# EAGLE design Encoder (EAGLE 9.5.0)
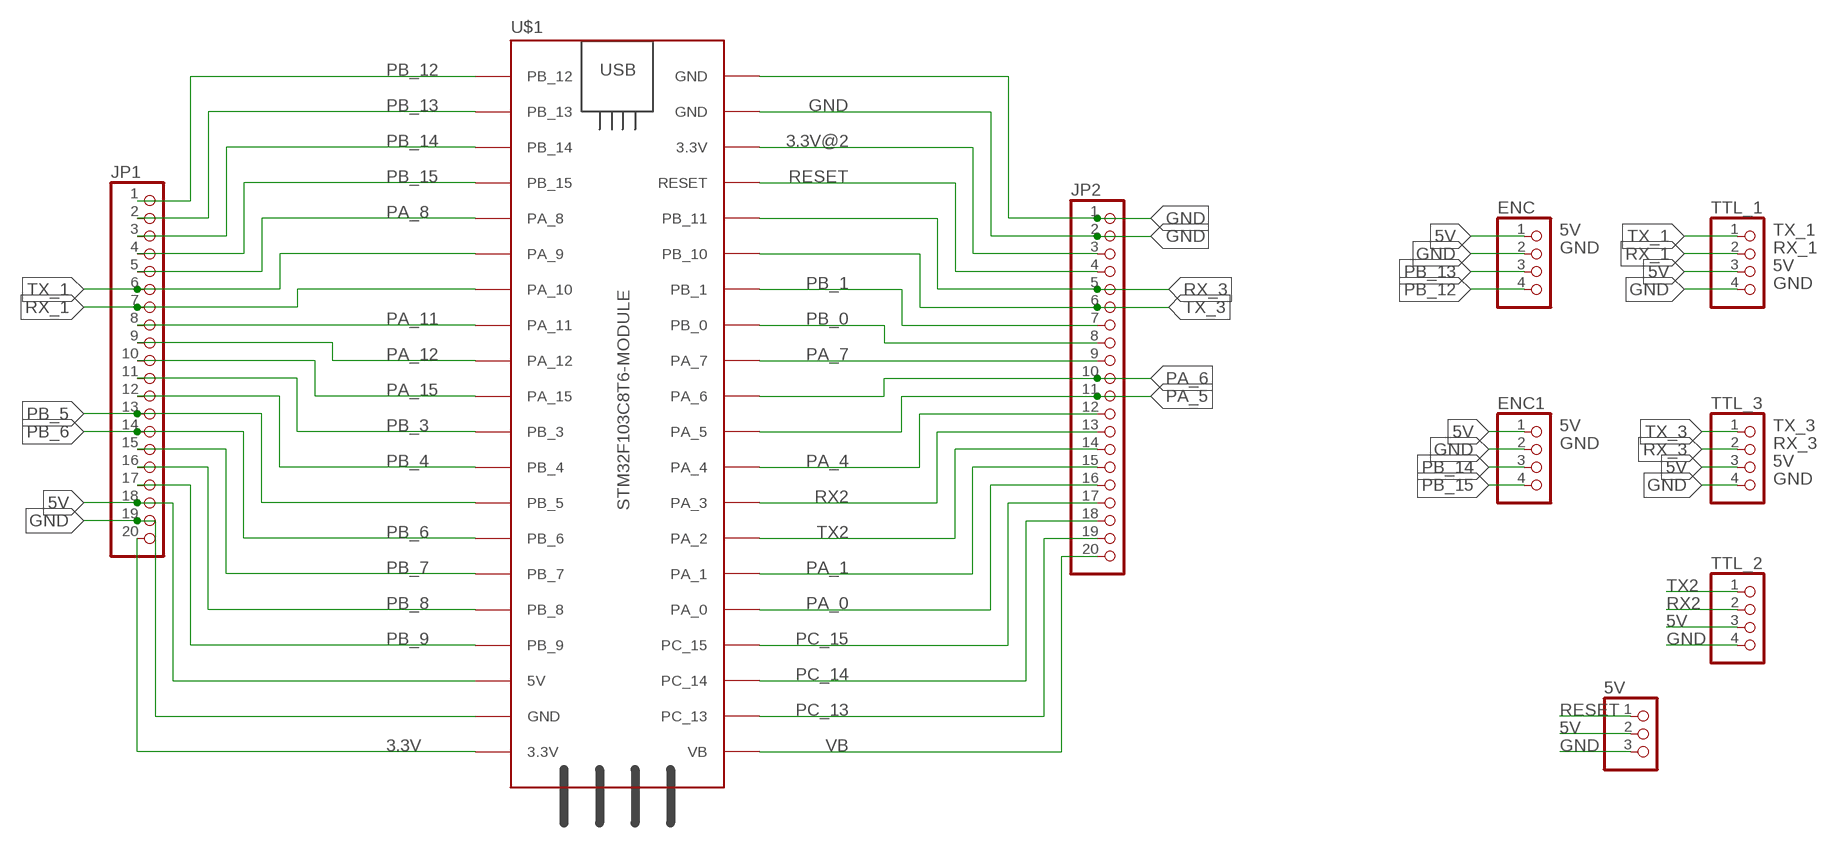
[diagram p0: schematic, sheet 1]

## Parts
5V  PINHD-3_DATA  [1X03_DATA]
ENC  PINHD-4_DATA  [1X04_DATA]
ENC1  PINHD-4_DATA  [1X04_DATA]
JP1  PINHD-1X20  [1X20]
JP2  PINHD-1X20  [1X20]
TTL_1  PINHD-4_DATA  [1X04_DATA]
TTL_2  PINHD-4_DATA  [1X04_DATA]
TTL_3  PINHD-4_DATA  [1X04_DATA]
U$1  STM32F103C8T6-MODULE  [STM32F103C8T6-MODULE]

## Nets
3.3V: JP1.20 U$1.3.3V_1(3.3V)
3.3V@2: JP2.3 U$1.3.3V_2(3.3V)
5V: 5V.2 ENC1.1 ENC.1 JP1.18 TTL_1.3 TTL_2.3 TTL_3.3 U$1.5V
GND: 5V.3 ENC1.2 ENC.2 JP1.19 JP2.1 JP2.2 TTL_1.4 TTL_2.4 TTL_3.4 U$1.GND_1(GND) U$1.GND_2(GND) U$1.GND_3(GND)
PA_0: JP2.16 U$1.PA_0
PA_1: JP2.15 U$1.PA_1
PA_4: JP2.12 U$1.PA_4
PA_5: JP2.11 U$1.PA_5
PA_6: JP2.10 U$1.PA_6
PA_7: JP2.9 U$1.PA_7
PA_8: JP1.5 U$1.PA_8
PA_11: JP1.8 U$1.PA_11
PA_12: JP1.9 U$1.PA_12
PA_15: JP1.10 U$1.PA_15
PB_0: JP2.8 U$1.PB_0
PB_1: JP2.7 U$1.PB_1
PB_3: JP1.11 U$1.PB_3
PB_4: JP1.12 U$1.PB_4
PB_5: JP1.13 U$1.PB_5
PB_6: JP1.14 U$1.PB_6
PB_7: JP1.15 U$1.PB_7
PB_8: JP1.16 U$1.PB_8
PB_9: JP1.17 U$1.PB_9
PB_12: ENC.4 JP1.1 U$1.PB_12
PB_13: ENC.3 JP1.2 U$1.PB_13
PB_14: ENC1.3 JP1.3 U$1.PB_14
PB_15: ENC1.4 JP1.4 U$1.PB_15
PC_13: JP2.19 U$1.PC_13
PC_14: JP2.18 U$1.PC_14
PC_15: JP2.17 U$1.PC_15
RESET: 5V.1 JP2.4 U$1.RESET
RX2: JP2.13 TTL_2.2 U$1.PA_3
RX_1: JP1.7 TTL_1.2 U$1.PA_10
RX_3: JP2.5 TTL_3.2 U$1.PB_11
TX2: JP2.14 TTL_2.1 U$1.PA_2
TX_1: JP1.6 TTL_1.1 U$1.PA_9
TX_3: JP2.6 TTL_3.1 U$1.PB_10
VB: JP2.20 U$1.VB

## Library data of the parts
5V = MIA_LIBRARY-2-2-2:PINHD-3_DATA: PIN HEADER
ENC ENC1 TTL_1-TTL_3 = MIA_LIBRARY-2-2-2:PINHD-4_DATA: PIN HEADER
JP1 JP2 = pinhead:PINHD-1X20: PIN HEADER
U$1 = MIA_LIBRARY-2-2-2:STM32F103C8T6-MODULE: STM32F103C8T6 module with ARM Cortex-3, 20kB SRAM, 64kB Flash, 72MHz

## Board
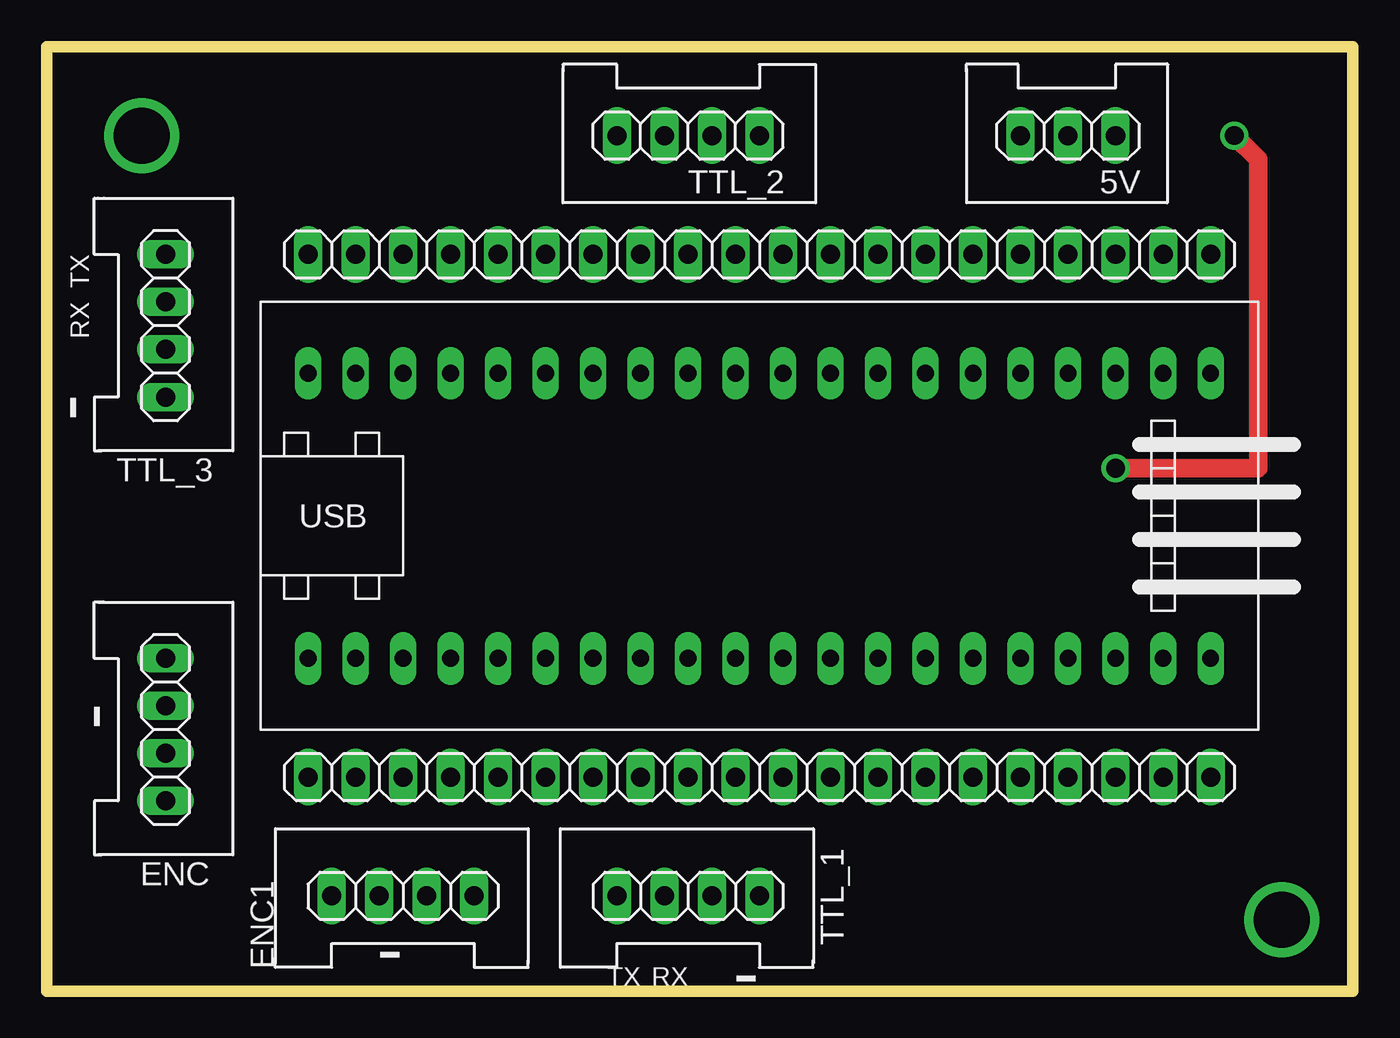
[diagram p1: board, top side]
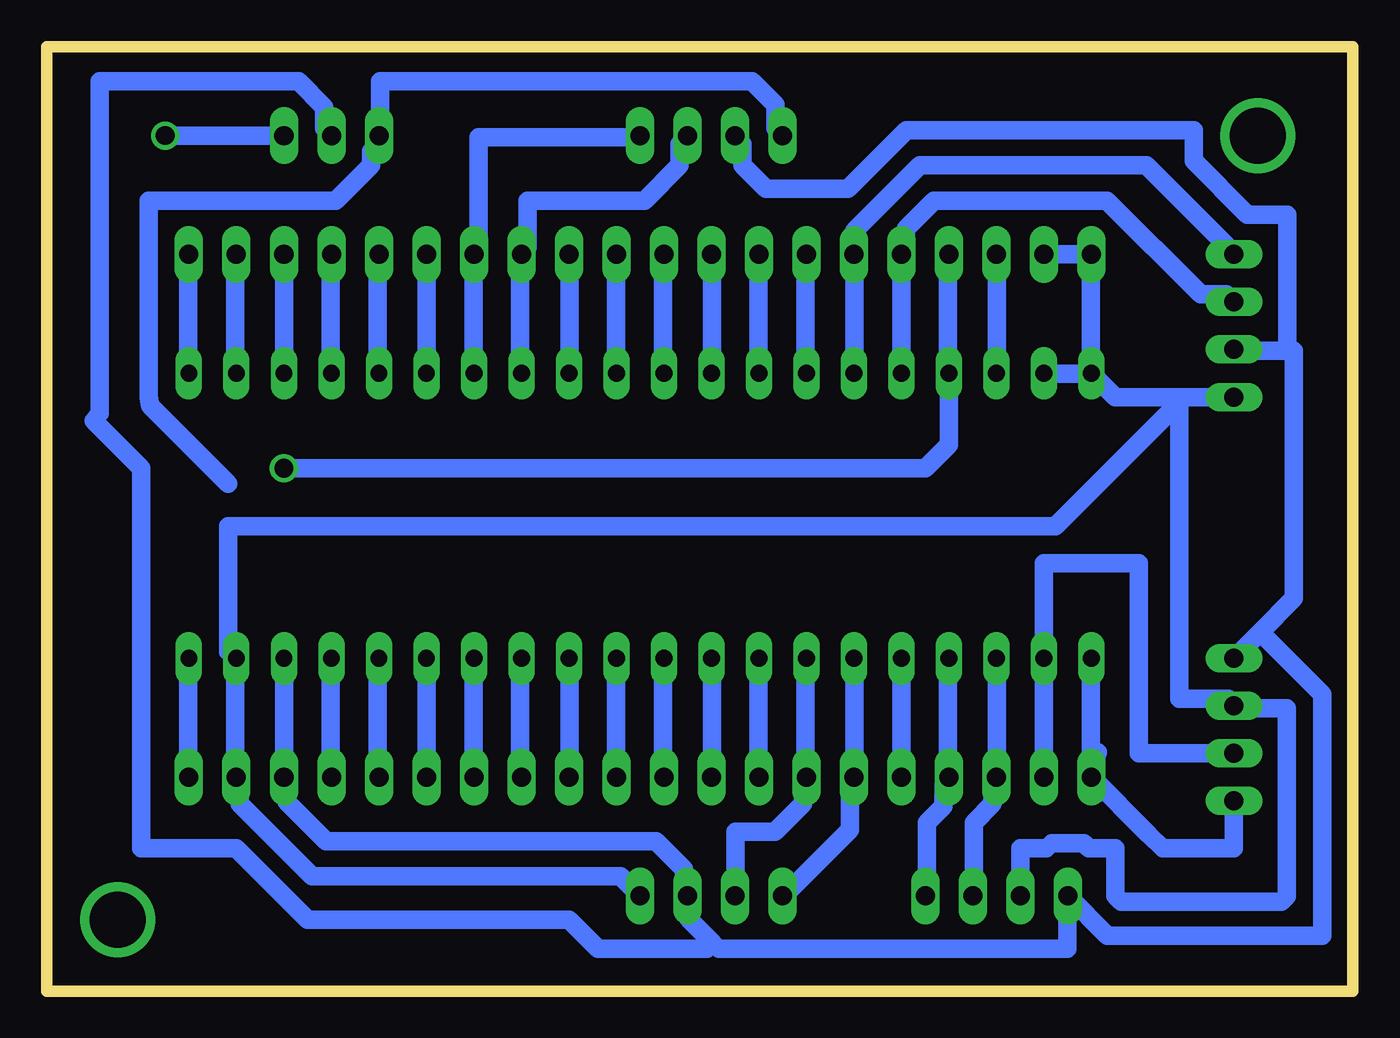
[diagram p2: board, bottom side, seen from below]

Size 69.83 x 50.47 mm. Coordinates in mm from the lower left corner, seen from the top.
Outline: 0,0 69.83,0 69.83,50.47 0,50.47 0,0
Copper layers (1*16): Top 0.035mm / dielectric 1.5mm / Bottom 0.035mm
Design rules "default *": minimum track width 1mm, minimum drill 1mm, track to track 0.8mm, track to pad 0.8mm, pad to pad 6mil, via to via 6mil, smd to smd 6mil, copper to edge 0.8mm, drill to drill 0.8mm, minimum pad ring 10mil, minimum via ring 8mil, stop-mask expansion 4mil, vias tented up to drill 0mil, thermal gap 10mil

### Footprints (pad centres in the part's own frame; a part is rotated, then mirrored left to right if it is on the bottom)
1X03_DATA = drill 1.016 long: 1 -2.54,0; 2 0,0; 3 2.54,0
1X04_DATA = drill 1.016 long: 1 -3.81,0; 2 -1.27,0; 3 1.27,0; 4 3.81,0
1X20 = drill 1.016 long: 1 -24.13,0; 2 -21.59,0; 3 -19.05,0; 4 -16.51,0; 5 -13.97,0; 6 -11.43,0; 7 -8.89,0; 8 -6.35,0; 9 -3.81,0; 10 -1.27,0; 11 1.27,0; 12 3.81,0; 13 6.35,0; 14 8.89,0; 15 11.43,0; 16 13.97,0; 17 16.51,0; 18 19.05,0; 19 21.59,0; 20 24.13,0
STM32F103C8T6-MODULE = drill 0.9 long: 3.3V_1 25.4,-7.62; 3.3V_2 -17.78,7.62; 5V 20.32,-7.62; GND_1 22.86,-7.62; GND_2 -20.32,7.62; GND_3 -22.86,7.62; PA_0 15.24,7.62; PA_1 12.7,7.62; PA_2 10.16,7.62; PA_3 7.62,7.62; PA_4 5.08,7.62; PA_5 2.54,7.62; PA_6 0,7.62; PA_7 -2.54,7.62; PA_8 -12.7,-7.62; PA_9 -10.16,-7.62; PA_10 -7.62,-7.62; PA_11 -5.08,-7.62; PA_12 -2.54,-7.62; PA_15 0,-7.62; PB_0 -5.08,7.62; PB_1 -7.62,7.62; PB_3 2.54,-7.62; PB_4 5.08,-7.62; PB_5 7.62,-7.62; PB_6 10.16,-7.62; PB_7 12.7,-7.62; PB_8 15.24,-7.62; PB_9 17.78,-7.62; PB_10 -10.16,7.62; PB_11 -12.7,7.62; PB_12 -22.86,-7.62; PB_13 -20.32,-7.62; PB_14 -17.78,-7.62; PB_15 -15.24,-7.62; PC_13 22.86,7.62; PC_14 20.32,7.62; PC_15 17.78,7.62; RESET -15.24,7.62; VB 25.4,7.62

### Placement (x,y rotation side)
5V  54.61,45.72 180 top
ENC  6.35,13.97 270 top
ENC1  19.05,5.08 0 top
JP1  38.1,11.43 0 top
JP2  38.1,39.37 0 top
TTL_1  34.29,5.08 0 top
TTL_2  34.29,45.72 180 top
TTL_3  6.35,35.56 270 top
U$1  36.83,25.4 0 top

### Tracks (layer width: path | path; a pad name or v marks a point on that pad's centre or on a via)
3.3V
  Bottom 1: U$1.3.3V_1 62.27,17.75 62.27,11.5 JP1.20
3.3V@2
  Bottom 1: U$1.3.3V_2 19.02,33.12 19.02,39.25 JP2.3
5V
  Bottom 1: 4.95,19.19 3.14,21 3.14,34.23 3.5,34.23 | 4.95,19.19 6.26,17.88 ENC.1 | 3.5,34.23 6.26,34.23 TTL_3.3 | U$1.5V 57.14,17.75 57.14,11.5 JP1.18 57.02,11 57.02,10.12 54.89,8 37.27,8 35.77,6.5 35.77,5.5 TTL_1.3 35.52,5 35.52,3.88 34.2,2.56 | 34.2,2.56 33.89,2.25 15.27,2.25 15.27,5 ENC1.1 13.12,2.96 1.64,2.96 1.64,15.88 4.95,19.19 | 34.2,2.56 34.52,2.25 40.35,2.25 41.91,3.81 55.88,3.81 59.69,7.62 64.77,7.62 64.77,27.94 67.31,30.48 67,30.88 67,48.62 56.38,48.62 55,47.25 55,46.12 54.62,45.75 5V.2 | 3.5,34.23 3.5,41.5 5.62,41.5 8.5,44.38 8.5,46 23.88,46 27,42.88 31.38,42.88 32.62,44.12 32.62,45.25 33,45.62 TTL_2.3
GND
  Bottom 1: JP2.2 16.39,39.38 14.02,39.38 JP2.1 14.02,38.88 14.02,33.5 U$1.GND_3 | U$1.GND_3 14.02,33 16.39,33 U$1.GND_2 | U$1.GND_3 12.68,31.73 9.27,31.73 | 9.27,31.73 6.39,31.73 TTL_3.4 | ENC1.2 17.77,5.12 17.78,5.14 17.78,7.62 16.38,7.62 16.09,7.9 14.39,7.9 14.1,7.62 12.7,7.62 12.7,5.09 12.37,4.76 3.81,4.76 3.52,5.05 3.52,15.12 6.26,15.12 ENC.2 6.64,15.62 9.27,15.62 9.27,31.11 | 9.27,31.11 9.27,31.73 | TTL_1.4 38.14,5.12 39.14,6.12 55.64,6.12 59.52,10 59.52,11 JP1.19 59.77,11.5 59.77,17.75 U$1.GND_1 60.14,18.12 60.14,24.84 15.91,24.84 9.64,31.11 9.27,31.11 | 60.14,27.12 64.29,31.28 64.38,31.75 64.38,42.25 54.38,42.25 52.5,44.12 52.5,44.88 52.12,45.25 5V.3 52,45.75 52,48.62 32.12,48.62 30.88,47.38 30.88,46.12 30.5,45.75 TTL_2.4
N$1  (via drill 3)
  other vias: 66.04,3.81
N$2  (via drill 3)
  other vias: 5.08,45.72
PA_0
  Bottom 1: U$1.PA_0 52.14,33.12 52.14,39.25 JP2.16
PA_1
  Bottom 1: U$1.PA_1 49.52,33.12 49.52,39.25 JP2.15
PA_4
  Bottom 1: U$1.PA_4 41.89,33.12 41.89,39.25 JP2.12
PA_5
  Bottom 1: U$1.PA_5 39.39,33.12 39.39,39.25 JP2.11
PA_6
  Bottom 1: U$1.PA_6 36.89,33.12 36.89,39.25 JP2.10
PA_7
  Bottom 1: U$1.PA_7 34.27,33.12 34.27,39.25 JP2.9
PA_8
  Bottom 1: U$1.PA_8 24.14,17.75 24.14,11.5 JP1.5
PA_11
  Bottom 1: U$1.PA_11 31.77,17.75 31.77,11.5 JP1.8
PA_12
  Bottom 1: U$1.PA_12 34.27,17.75 34.27,11.5 JP1.9
PA_15
  Bottom 1: U$1.PA_15 36.89,17.75 36.89,11.5 JP1.10
PB_0
  Bottom 1: U$1.PB_0 31.77,33.12 31.77,39.25 JP2.8
PB_1
  Bottom 1: U$1.PB_1 29.27,33.12 29.27,39.25 JP2.7
PB_3
  Bottom 1: U$1.PB_3 39.39,17.75 39.39,11.5 JP1.11
PB_4
  Bottom 1: U$1.PB_4 41.89,17.75 41.89,11.5 JP1.12
PB_5
  Bottom 1: U$1.PB_5 44.52,17.75 44.52,11.5 JP1.13
PB_6
  Bottom 1: U$1.PB_6 47.02,17.75 47.02,11.5 JP1.14
PB_7
  Bottom 1: U$1.PB_7 49.52,17.75 49.52,11.5 JP1.15
PB_8
  Bottom 1: U$1.PB_8 52.14,17.75 52.14,11.5 JP1.16
PB_9
  Bottom 1: U$1.PB_9 54.64,17.75 54.64,11.5 JP1.17
PB_12
  Bottom 1: 14.02,11.5 14.02,17.75 U$1.PB_12 | 14.02,11.5 JP1.1 13.64,12.75 | ENC.4 6.35,7.62 10.16,7.62 10.9,8.36 10.9,8.37 14.02,11.48 14.02,11.5
PB_13
  Bottom 1: 16.52,17.75 16.52,11.5 JP1.2 | 16.52,17.75 U$1.PB_13 | ENC.3 11.43,12.7 11.43,22.86 16.51,22.86 16.52,22.86 16.52,17.75
PB_14
  Bottom 1: U$1.PB_14 19.02,17.75 19.02,11.5 JP1.3 19.27,11 19.27,10 20.27,9 20.27,5.12 ENC1.3
PB_15
  Bottom 1: U$1.PB_15 21.64,17.75 21.64,11.5 JP1.4 21.89,11 21.89,9.88 22.77,9 22.77,5.12 ENC1.4
PC_13
  Bottom 1: U$1.PC_13 59.77,33.12 59.77,39.25 JP2.19
PC_14
  Bottom 1: U$1.PC_14 57.14,33.12 57.14,39.25 JP2.18
PC_15
  Bottom 1: U$1.PC_15 54.64,33.12 54.64,39.25 JP2.17
RESET  (via drill 1)
  Top 1: v63.5,45.72 64.77,44.45 64.77,27.94 v57.15,27.94
  Bottom 1: 21.64,33.12 21.64,39.25 JP2.4 | 21.64,33.12 U$1.RESET | 5V.1 v63.5,45.72 | v57.15,27.94 22.86,27.94 21.59,29.21 21.59,33.08 21.64,33.12
RX2
  Bottom 1: U$1.PA_3 44.52,33.12 44.52,39.25 JP2.13 44.12,39.75 44.12,42.25 37.88,42.25 36,44.12 36,45.25 35.62,45.62 TTL_2.2
RX_1
  Bottom 1: U$1.PA_10 29.27,17.75 29.27,11.5 JP1.7 29.39,11 29.39,10 30.89,8.5 33.02,8.5 33.02,5.12 TTL_1.2
RX_3
  Bottom 1: U$1.PB_11 24.14,33.12 24.14,39.25 JP2.5 23.89,39.75 23.89,40.75 22.39,42.25 13.14,42.25 8.12,37.23 6.76,37.23 6.39,36.85 TTL_3.2
TX2
  Bottom 1: U$1.PA_2 47.02,33.12 47.02,39.25 JP2.14 46.75,39.75 46.75,45.62 38.12,45.62 TTL_2.1
TX_1
  Bottom 1: U$1.PA_9 26.64,17.75 26.64,11.5 JP1.6 26.89,11 26.89,8.62 30.39,5.12 TTL_1.1
TX_3
  Bottom 1: U$1.PB_10 26.64,33.12 26.64,39.25 JP2.6 26.64,39.88 26.64,40.62 23.14,44.12 11.04,44.12 6.39,39.48 TTL_3.1
VB
  Bottom 1: U$1.VB 62.27,33.12 62.27,39.25 JP2.20

### Text on the board
tNames: TX | RX | - | - | - | - | TX | RX